# Altium schematic sheet FX_MCU.SchDoc
size A4
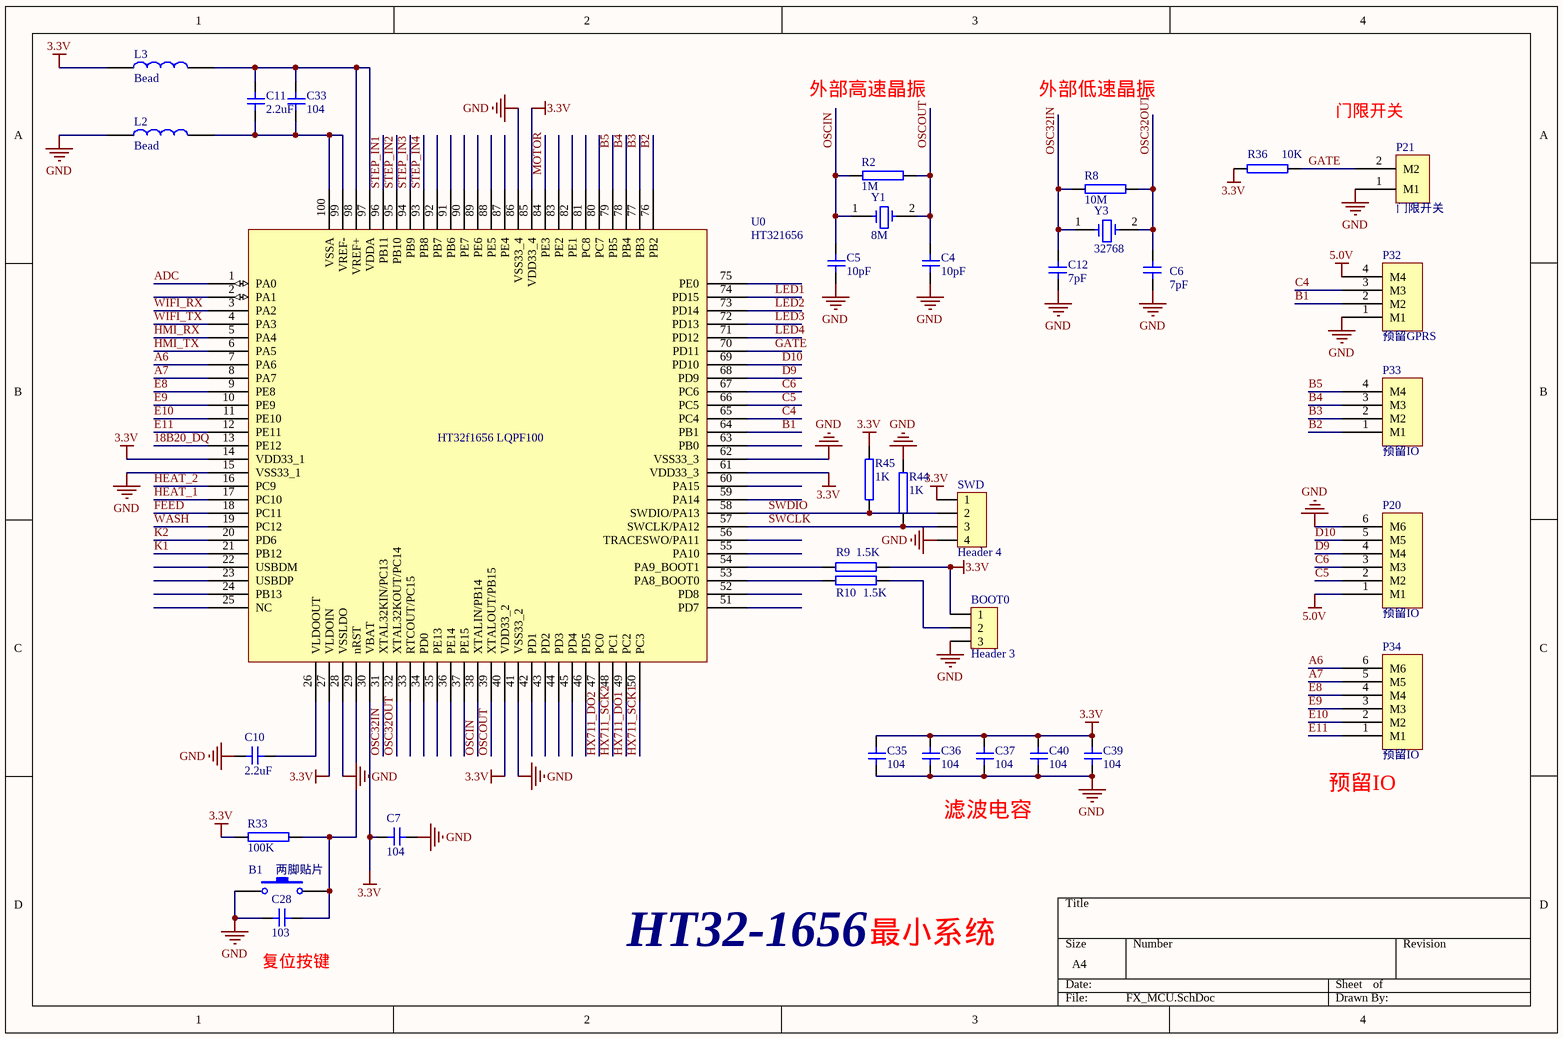
[diagram p0: FX_MCU.SchDoc]

## Parts
B1  两脚贴片  [贴片按键]
BOOT0  Header 3  [Header 3]
C4  10pF  [0805C]
C5  10pF  [0805C]
C6  7pF  [0805C]
C7  104  [0805C]
C10  2.2uF  [0805C]
C11  2.2uF  [0805C]
C12  7pF  [0805C]
C28  103  [0805C]
C33  104  [0805C]
C35  104  [0805C]
C36  104  [0805C]
C37  104  [0805C]
C39  104  [0805C]
C40  104  [0805C]
L2  Bead  [0805L]
L3  Bead  [0805L]
P20  预留IO  [接线端子(小)-6PIN]
P21  门限开关  [接线端子(小)-2PIN]
P32  预留GPRS  [接线端子(小)-4PIN]
P33  预留IO  [接线端子(小)-4PIN]
P34  预留IO  [接线端子(小)-6PIN]
R2  1M  [0805R]
R8  10M  [0805R]
R9  1.5K  [0805R]
R10  1.5K  [0805R]
R33  100K  [0805R]
R36  10K  [0805R]
R44  1K  [0805R]
R45  1K  [0805R]
SWD  Header 4  [Header 4]
U0  HT321656  [LQFP100]
Y1  8M  [22M(晶振)]
Y3  32768  [XTAL]

## Nets
3.3V: BOOT0.1 C7.2 C35.2 C36.2 C37.2 C39.2 C40.2 L3.1 R9.2 R33.1 R36.1 R45.2 SWD.1 U0.14(VDD33_1) U0.27(VLDOIN) U0.30(VBAT) U0.40(VDD33_2) U0.61(VDD33_3) U0.85(VDD33_4)
5.0V: P20.1(M1) P32.4(M4)
GND: B1.1 BOOT0.3 C4.1 C5.1 C6.2 C7.1 C10.2 C12.2 C28.2 C35.1 C36.1 C37.1 C39.1 C40.1 L2.1 P20.6(M6) P21.1(M1) P32.1(M1) R44.2 SWD.4 U0.15(VSS33_1) U0.28(VSSLDO) U0.41(VSS33_2) U0.62(VSS33_3) U0.86(VSS33_4)
18B20_DQ: U0.13(PE12)
A6: P34.6(M6) U0.7(PA6)
A7: P34.5(M5) U0.8(PA7)
ADC: U0.1(PA0)
B1: P32.2(M2) U0.64(PB1)
B2: P33.1(M1) U0.76(PB2)
B3: P33.2(M2) U0.77(PB3)
B4: P33.3(M3) U0.78(PB4)
B5: P33.4(M4) U0.79(PB5)
C4: P32.3(M3) U0.65(PC4)
C5: P20.2(M2) U0.66(PC5)
C6: P20.3(M3) U0.67(PC6)
D9: P20.4(M4) U0.68(PD9)
D10: P20.5(M5) U0.69(PD10)
E8: P34.4(M4) U0.9(PE8)
E9: P34.3(M3) U0.10(PE9)
E10: P34.2(M2) U0.11(PE10)
E11: P34.1(M1) U0.12(PE11)
FEED: U0.18(PC11)
GATE: P21.2(M2) R36.2 U0.70(PD11)
HEAT_1: U0.17(PC10)
HEAT_2: U0.16(PC9)
HMI_RX: U0.5(PA4)
HMI_TX: U0.6(PA5)
HX711_DO1: U0.49(PC2)
HX711_DO2: U0.47(PC0)
HX711_SCK1: U0.50(PC3)
HX711_SCK2: U0.48(PC1)
K1: U0.21(PB12)
K2: U0.20(PD6)
LED1: U0.74(PD15)
LED2: U0.73(PD14)
LED3: U0.72(PD13)
LED4: U0.71(PD12)
MOTOR: U0.84(PE3)
OSC32IN: C12.1 R8.1 U0.31(XTAL32KIN/PC13) Y3.1
OSC32OUT: C6.1 R8.2 U0.32(XTAL32KOUT/PC14) Y3.2
OSCIN: C5.2 R2.1 U0.38(XTALIN/PB14) Y1.1
OSCOUT: C4.2 R2.2 U0.39(XTALOUT/PB15) Y1.2
STEP_IN1: U0.96(PB11)
STEP_IN2: U0.95(PB10)
STEP_IN3: U0.94(PB9)
STEP_IN4: U0.93(PB8)
SWCLK: R44.1 SWD.3 U0.57(SWCLK/PA12)
SWDIO: R45.1 SWD.2 U0.58(SWDIO/PA13)
WASH: U0.19(PC12)
WIFI_RX: U0.3(PA2)
WIFI_TX: U0.4(PA3)
NetB1_2: B1.2 C28.1 R33.2 U0.29(nRST)
NetBOOT0_2: BOOT0.2 R10.2
NetC10_1: C10.1 U0.26(VLDOOUT)
NetC11_1: C11.1 C33.1 L2.2 U0.99(VREF-) U0.100(VSSA)
NetC11_2: C11.2 C33.2 L3.2 U0.97(VDDA) U0.98(VREF+)
NetR9_1: R9.1 U0.54(PA9_BOOT1)
NetR10_1: R10.1 U0.53(PA8_BOOT0)

Not connected (* = marked no-connect by the designer): U0 2(PA1) 22(USBDM) 23(USBDP) 24(PB13) 25(NC) 33(RTCOUT/PC15) 34(PD0) 35(PE13) 36(PE14) 37(PE15) 42(PD1) 43(PD2) 44(PD3) 45(PD4) 46(PD5) 51(PD7) 52(PD8) 55(PA10) 56(TRACESWO/PA11) 59(PA14) 60(PA15) 63(PB0) 75(PE0) 80(PC7) 81(PC8) 82(PE1) 83(PE2) 87(PE4) 88(PE5) 89(PE6) 90(PE7) 91(PB6) 92(PB7)

## Notes on the sheet
- 外部高速晶振
- 外部低速晶振
- 门限开关
- (near P34) 预留IO
- 滤波电容
- (near C28) 复位按键
- HT32-1656
- 最小系统
- (in symbol HT321656) HT32f1656 LQPF100

## Library data of the parts
B1 = Key(两脚贴片)
C4-C7 C10-C12 C28 C33 C35-C37 C39 C40 = C1
L2 L3 = L1
P20 P34 = 接线端子(小)-6PIN
P21 = 接线端子(小)-2PIN
P32 P33 = 接线端子(小)-4PIN
R2 R8-R10 R33 R36 R44 R45 = R1
Y1 Y3 = XTAL